# EAGLE schematic Infanem Second Voice (EAGLE 5.06)
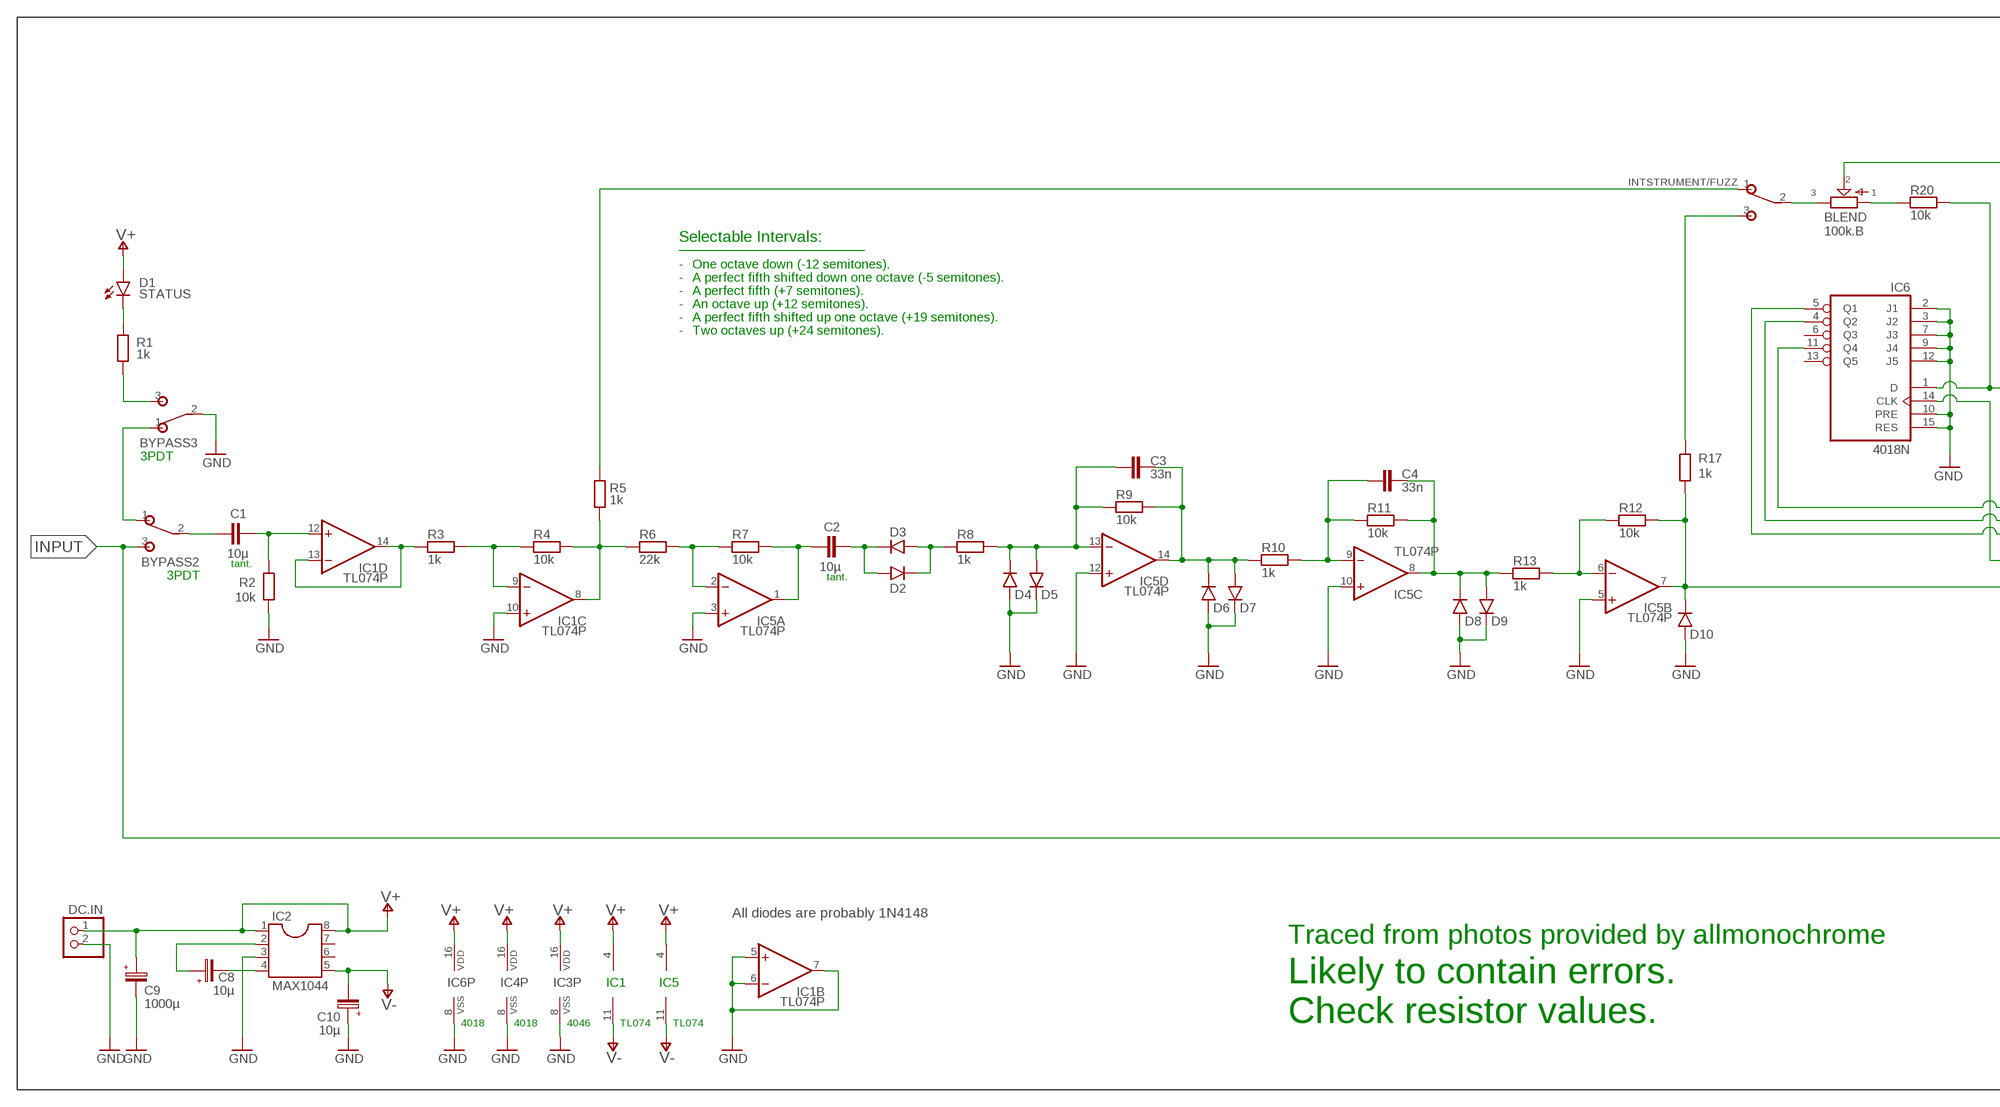
[diagram p0: schematic, sheet 1, part 1 of 2]
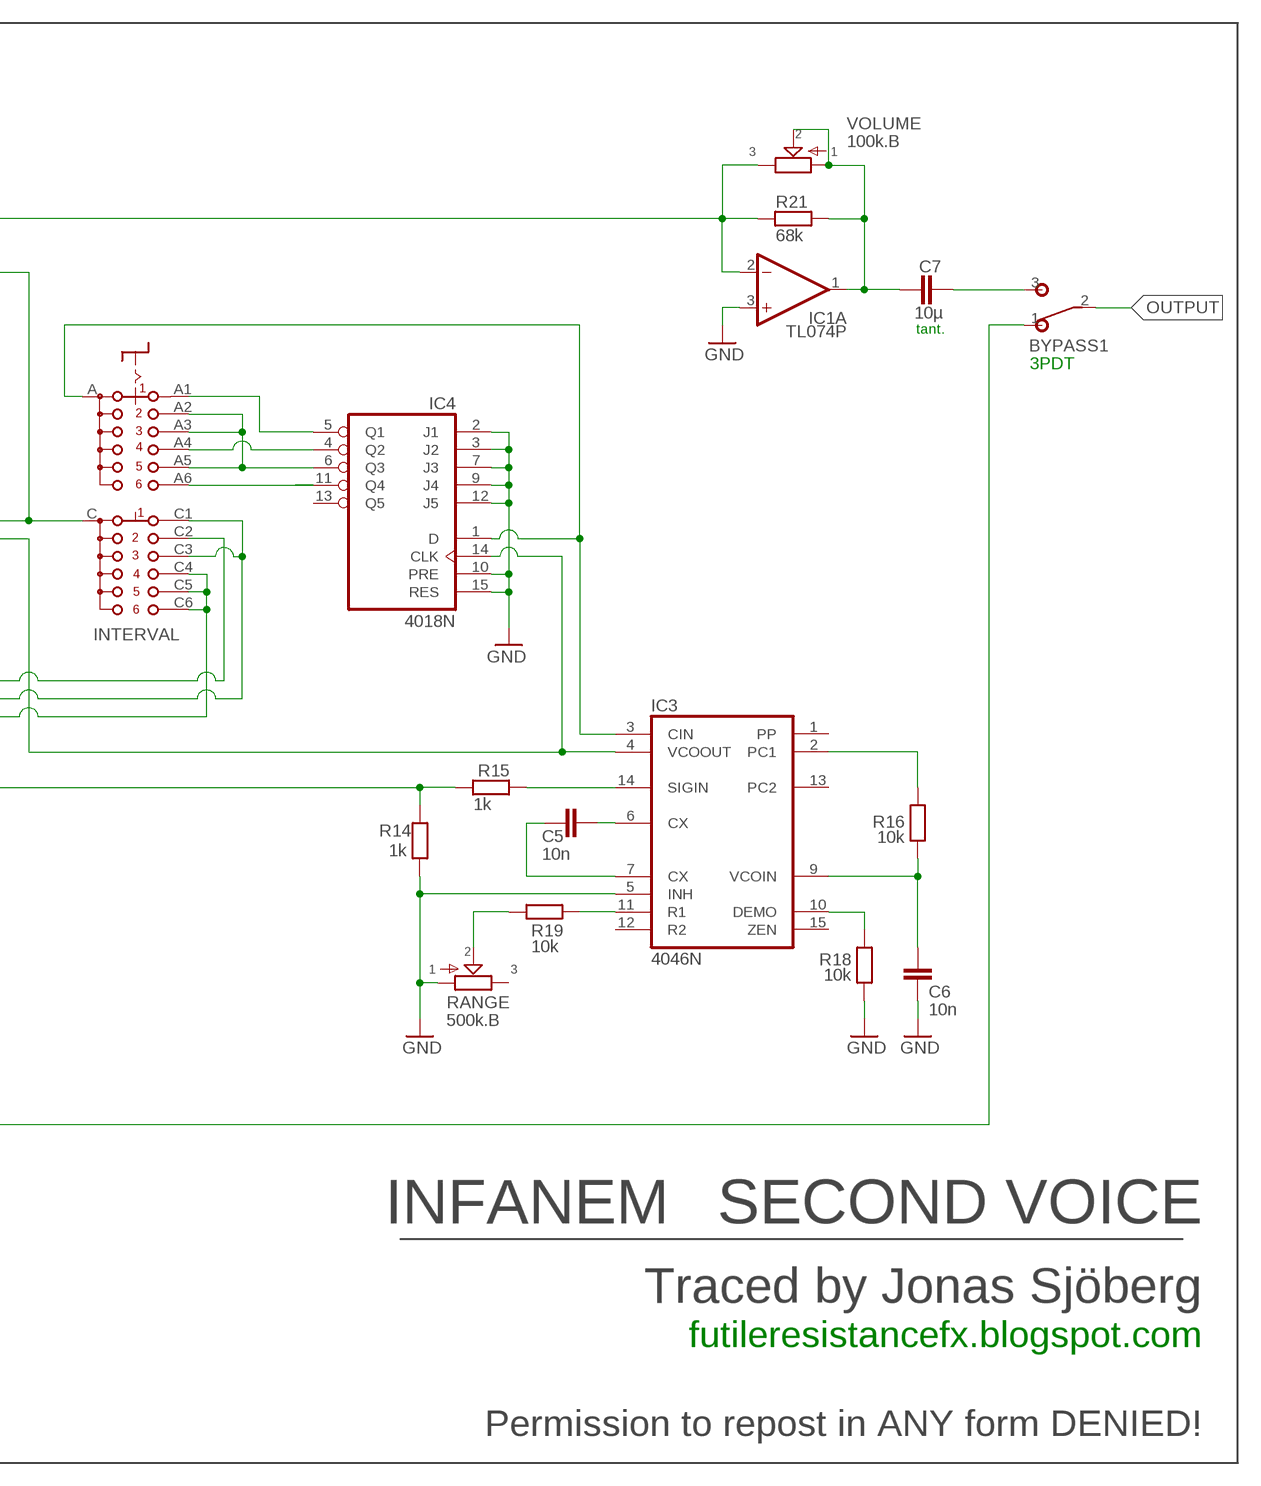
[diagram p1: schematic, sheet 1, part 2 of 2]

## Parts
BLEND  100k.B  POT-EU  [POT]
BYPASS1  SPDTPADS  [SPDT]
BYPASS2  SPDTPADS  [SPDT]
BYPASS3  SPDTPADS  [SPDT]
C1  10µ  072X0252  [072X025]
C2  10µ  072X0252  [072X025]
C3  33n  072X0252  [072X025]
C4  33n  072X0252  [072X025]
C5  10n  072X0252  [072X025]
C6  10n  072X0252  [072X025]
C7  10µ  072X0252  [072X025]
C8  10µ  050-EU  [050_020]
C9  1000µ  050-EU  [050_020]
C10  10µ  050-EU  [050_020]
D1  STATUS  LED5MM  [LED5MM]
D2  1N4148  1N4148-2  [DO35-2]
D3  1N4148  1N4148-2  [DO35-2]
D4  1N4148  1N4148-2  [DO35-2]
D5  1N4148  1N4148-2  [DO35-2]
D6  1N4148  1N4148-2  [DO35-2]
D7  1N4148  1N4148-2  [DO35-2]
D8  1N4148  1N4148-2  [DO35-2]
D9  1N4148  1N4148-2  [DO35-2]
D10  1N4148  1N4148-2  [DO35-2]
DC.IN  PINHD-1X2  [1X02]
IC1  TL074P  [DIL14]
IC2  MAX1044  [DIL08]
IC3  4046N  [DIL16]
IC4  4018N  [DIL16]
IC5  TL074P  [DIL14]
IC6  4018N  [DIL16]
INTERVAL  CK102X06  [CK102X06]
INTSTRUMENT/FUZZ  SPDTPADS  [SPDT]
R1  1k  6MM-EU  [R0207/3]
R2  10k  6MM-EU  [R0207/3]
R3  1k  6MM-EU  [R0207/3]
R4  10k  6MM-EU  [R0207/3]
R5  1k  6MM-EU  [R0207/3]
R6  22k  6MM-EU  [R0207/3]
R7  10k  6MM-EU  [R0207/3]
R8  1k  6MM-EU  [R0207/3]
R9  10k  6MM-EU  [R0207/3]
R10  1k  6MM-EU  [R0207/3]
R11  10k  6MM-EU  [R0207/3]
R12  10k  6MM-EU  [R0207/3]
R13  1k  6MM-EU  [R0207/3]
R14  1k  6MM-EU  [R0207/3]
R15  1k  6MM-EU  [R0207/3]
R16  10k  6MM-EU  [R0207/3]
R17  1k  6MM-EU  [R0207/3]
R18  10k  6MM-EU  [R0207/3]
R19  10k  6MM-EU  [R0207/3]
R20  10k  6MM-EU  [R0207/3]
R21  68k  6MM-EU  [R0207/3]
RANGE  500k.B  POT-EU  [POT]
VOLUME  100k.B  POT-EU  [POT]

## Nets
GND: BYPASS3.2(P) C6.2 C9.- C10.+ D4.A D5.C D6.A D7.C D8.A D9.C D10.A DC.IN.2 IC1.3(A:+IN) IC1.5(B:+IN) IC1.6(B:-IN) IC1.7(B:OUT) IC1.10(C:+IN) IC2.3 IC3.5(INH) IC3.8(VSS) IC4.2(J1) IC4.3(J2) IC4.7(J3) IC4.8(VSS) IC4.9(J4) IC4.10(PRE) IC4.12(J5) IC4.15(RES) IC5.3(A:+IN) IC5.5(B:+IN) IC5.10(C:+IN) IC5.12(D:+IN) IC6.2(J1) IC6.3(J2) IC6.7(J3) IC6.8(VSS) IC6.9(J4) IC6.10(PRE) IC6.12(J5) IC6.15(RES) R2.1 R14.2 R18.2 RANGE.1
INPUT: BYPASS1.1(O) BYPASS2.3(S)
N$2: BYPASS2.1(O) BYPASS3.1(O)
N$4: BYPASS3.3(S) R1.1
N$5: D1.K(C) R1.2
N$6: BYPASS2.2(P) C1.1
N$7: C1.2 IC1.12(D:+IN) R2.2
N$8: IC1.13(D:-IN) IC1.14(D:OUT) R3.2
N$9: IC1.9(C:-IN) R3.1 R4.2
N$10: IC1.8(C:OUT) R4.1 R5.2 R6.1
N$11: INTSTRUMENT/FUZZ.1(O) R5.1
N$12: IC5.2(A:-IN) R6.2 R7.2
N$13: C2.1 IC5.1(A:OUT) R7.1
N$14: C2.2 D2.A D3.C
N$15: D2.C D3.A R8.2
N$16: C3.1 D4.C D5.A IC5.13(D:-IN) R8.1 R9.2
N$17: IC3.14(SIGIN) R15.2
N$18: C3.2 D6.C D7.A IC5.14(D:OUT) R9.1 R10.2
N$19: IC5.6(B:-IN) R12.2 R13.1
N$20: C4.1 IC5.9(C:-IN) R10.1 R11.2
N$21: C4.2 D8.C D9.A IC5.8(C:OUT) R11.1 R13.2
N$22: D10.C IC5.7(B:OUT) R12.1 R14.1 R15.1 R17.1
N$23: C5.1 IC3.6(CX)
N$24: C5.2 IC3.7(CX)
N$25: C6.1 IC3.9(VCOIN) R16.2
N$26: IC3.2(PC1) R16.1
N$27: INTSTRUMENT/FUZZ.3(S) R17.2
N$28: IC3.10(DEMO) R18.1
N$29: IC3.11(R1) R19.2
N$30: R19.1 RANGE.2
N$31: IC3.4(VCOOUT) IC4.14(CLK) IC6.14(CLK)
N$32: IC4.11(Q4) INTERVAL.A6
N$33: IC4.6(Q3) INTERVAL.A2 INTERVAL.A3 INTERVAL.A5
N$34: IC4.5(Q1) INTERVAL.A1
N$35: IC4.4(Q2) INTERVAL.A4
N$37: IC6.4(Q2) INTERVAL.C1 INTERVAL.C3
N$38: IC3.3(CIN) IC4.1(D) INTERVAL.A
N$39: IC6.5(Q1) INTERVAL.C4 INTERVAL.C5 INTERVAL.C6
N$40: IC6.1(D) INTERVAL.C R20.2
N$41: C7.2 IC1.1(A:OUT) R21.2 VOLUME.1 VOLUME.2
N$42: IC6.11(Q4) INTERVAL.C2
N$43: C8.- IC2.4
N$44: BLEND.1 R20.1
N$45: BLEND.2 IC1.2(A:-IN) R21.1 VOLUME.3
N$46: BLEND.3 INTSTRUMENT/FUZZ.2(P)
N$47: BYPASS1.3(S) C7.1
N$48: C8.+ IC2.2
OUTPUT: BYPASS1.2(P)
V+: C9.+ D1.A DC.IN.1 IC1.4(P:V+) IC2.1 IC2.8 IC3.16(VDD) IC4.16(VDD) IC5.4(P:V+) IC6.16(VDD)
V-: C10.- IC1.11(P:V-) IC2.5 IC5.11(P:V-)
Unconnected: IC2.6 IC2.7 IC3.1(PP) IC3.12(R2) IC3.13(PC2) IC3.15(ZEN) IC4.13(Q5) IC6.6(Q3) IC6.13(Q5) RANGE.3

## Notes on the sheet
- Selectable Intervals:
- tant.
- - | One octave down (-12 semitones).
- 3PDT
- - | A perfect fifth shifted down one octave (-5 semitones).
- - | A perfect fifth (+7 semitones).
- - | An octave up (+12 semitones).
- - | A perfect fifth shifted up one octave (+19 semitones).
- - | Two octaves up (+24 semitones).
- 3PDT
- tant.
- tant.
- 3PDT
- INFANEM | SECOND VOICE
- All diodes are probably 1N4148
- Traced from photos provided by allmonochrome | Traced by Jonas Sjöberg
- IC1 | IC5 | Likely to contain errors. | futileresistancefx.blogspot.com
- Check resistor values.
- 4018 | 4018 | 4046 | TL074 | TL074
- Permission to repost in ANY form DENIED!

## Library data of the parts
BLEND RANGE VOLUME = gm-pots:POT-EU
BYPASS1-BYPASS3 INTSTRUMENT/FUZZ = gm-switches:SPDT: TOGGLE SWITCH Marquardt
C1-C7 = gm-caps-film-box:072X025: 1000pF - 0.47uF WIMA MKP2 63, 100V: 1000pF - 0.015uF; MKS2 50V: 0.33 - 0.47uF; 63V: 1000pF - 0.22uF;
C8-C10 = gm-caps-electro-pol:050-EU
D1 = gm-diodes:LED
D2-D10 = gm-diodes:1N4148: Fast Switching Diode DO-35 glass case a.k.a. 1N914
DC.IN = pinhead:PINHD-1X2: PIN HEADER
IC1 IC5 = gm-ics:TL074: OP AMP
IC2 = gm-ics:MAX1044
IC3 = 40xx:4046: Micropower PLL
IC4 IC6 = 40xx:4018: COUNTER/DIVIDER
INTERVAL = switch:CK102X06: ROTARY SWITCH C&K
R1-R21 = gm-resistors:6MM-EU: 6mm Resistors (European schematic symbol) Leads spaced 1-6 holes apart for 0.1" perfboard. Suitable for 1/4 watt resistors.